# Altium schematic sheet DIGITAL_OUTPUT.SchDoc: Digital output
size A3; Author: eldar6776@hotmail.com; DrawnBy: Eldar Dedic; Organization: PROVEN d.o.o.; Address1: Adema Buće 102; Address2: 71000 Sarajevo; Address3: Federacija BiH; Address4: Bosna i Hercegovina; DocumentNumber: CD-26514; Revision: 001; SheetNumber: 5; SheetTotal: 8; ProjectName: KONTROLER TRANSPORTA MATERIJALA
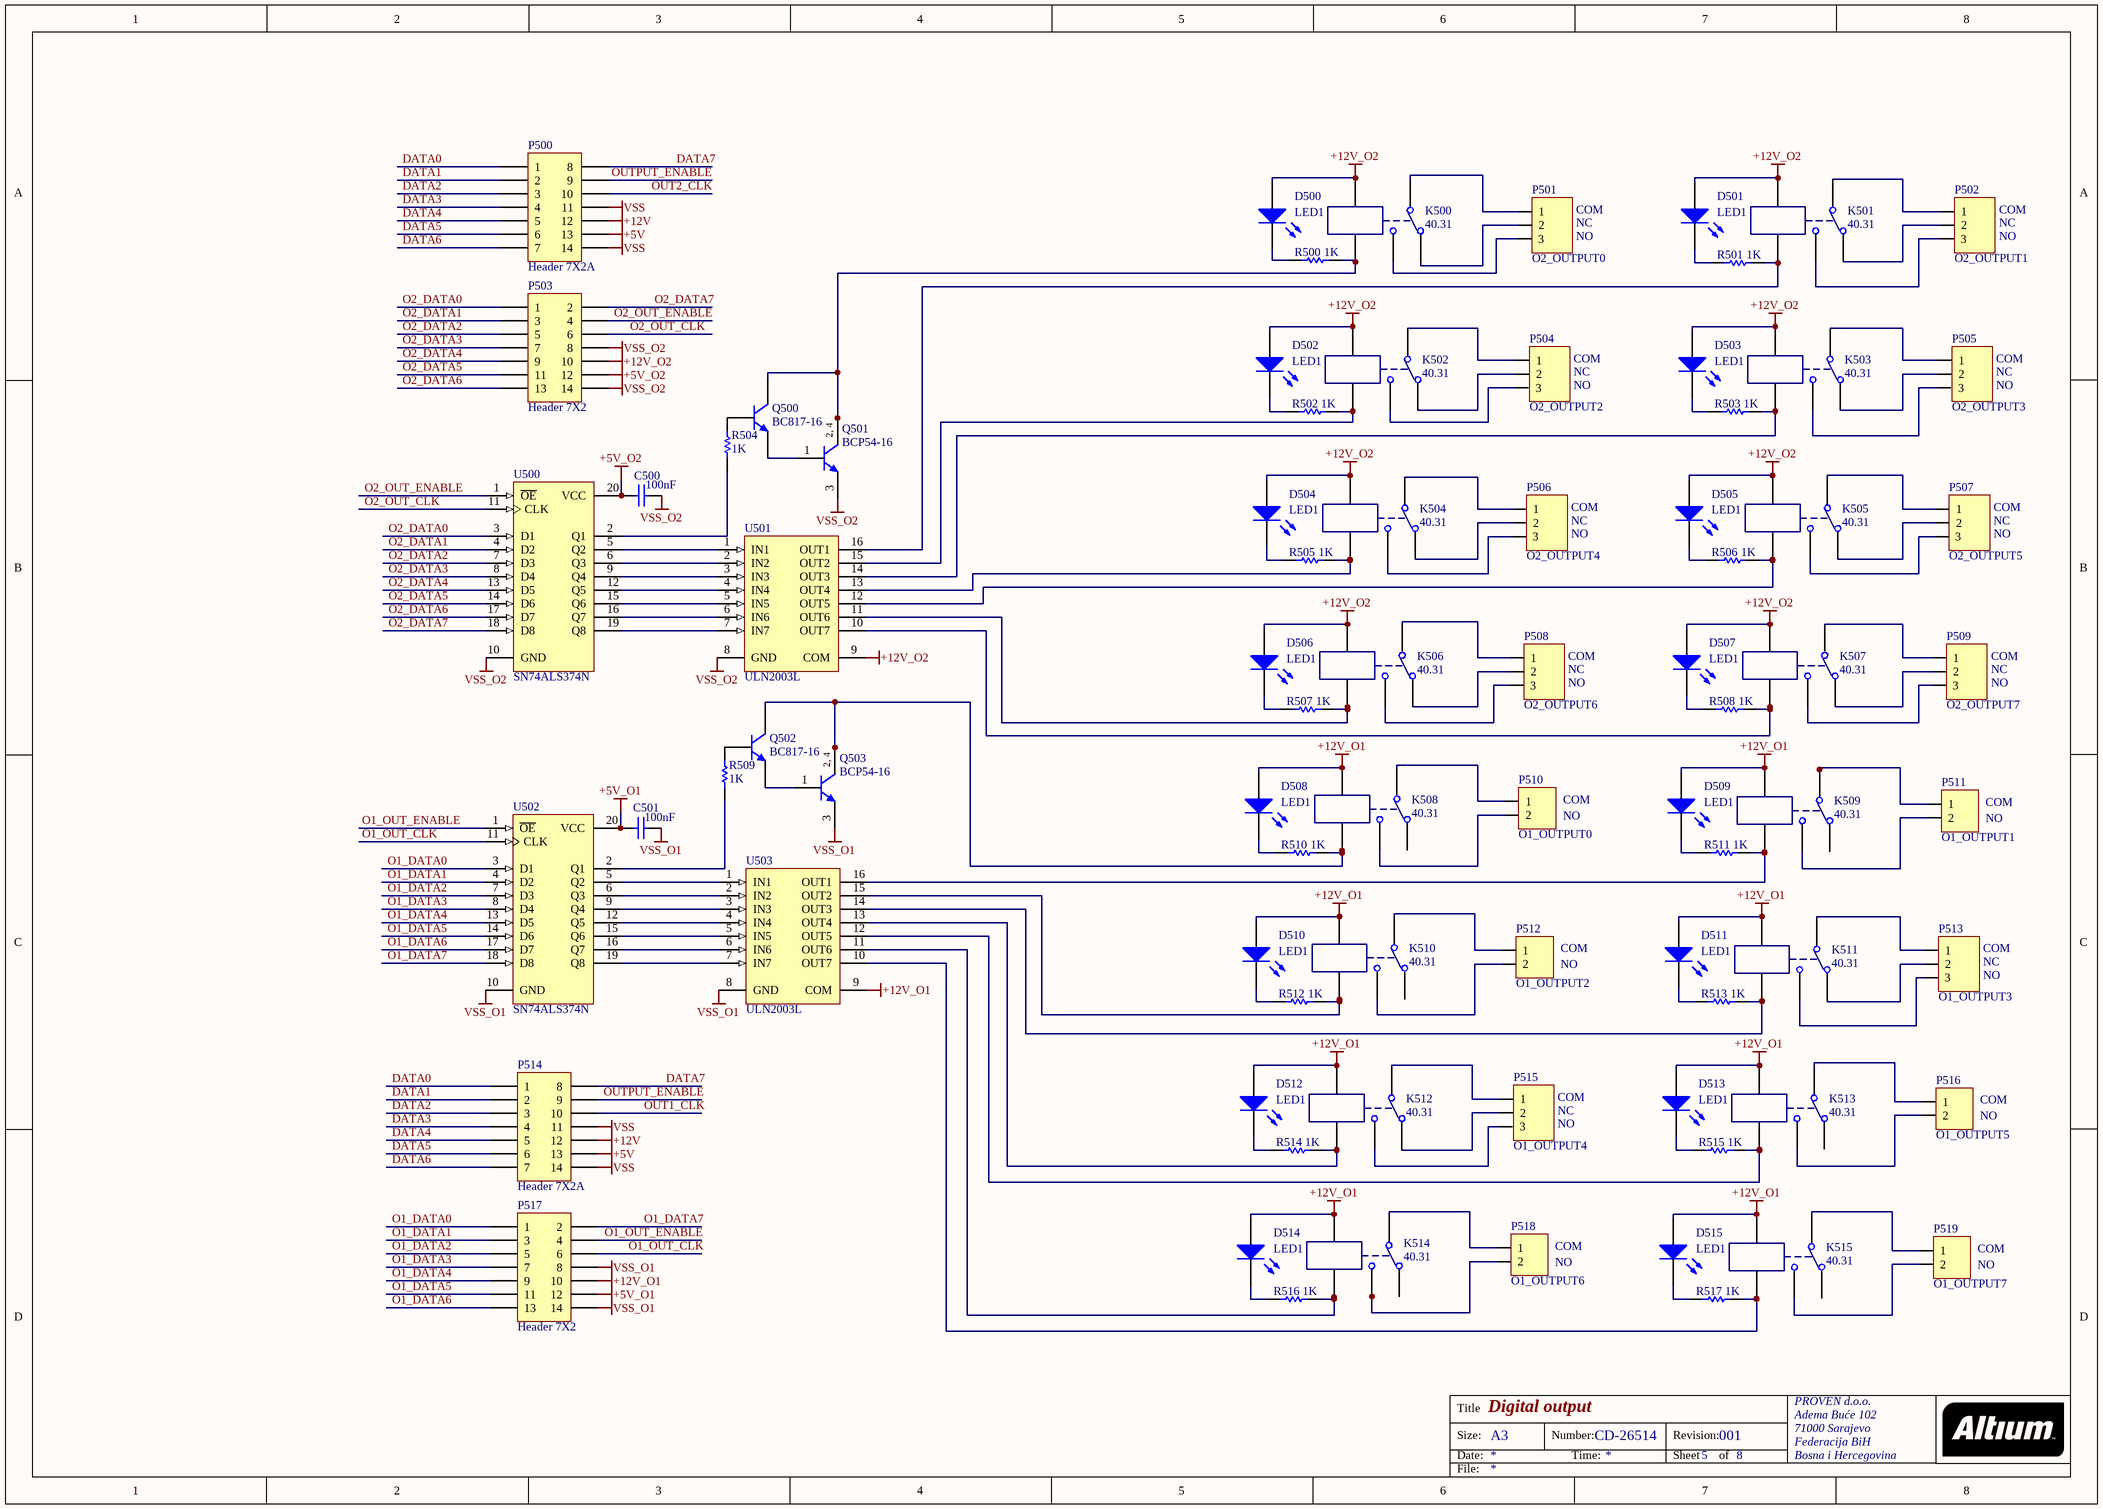
[diagram p0: DIGITAL_OUTPUT.SchDoc]

## Parts
C500  value 100nF  [1206]
C501  value 100nF  [1206]
D500  LED1  [LED-1]
D501  LED1  [LED-1]
D502  LED1  [LED-1]
D503  LED1  [LED-1]
D504  LED1  [LED-1]
D505  LED1  [LED-1]
D506  LED1  [LED-1]
D507  LED1  [LED-1]
D508  LED1  [LED-1]
D509  LED1  [LED-1]
D510  LED1  [LED-1]
D511  LED1  [LED-1]
D512  LED1  [LED-1]
D513  LED1  [LED-1]
D514  LED1  [LED-1]
D515  LED1  [LED-1]
K500  40.31  [40.31 FINDER]
K501  40.31  [40.31 FINDER]
K502  40.31  [40.31 FINDER]
K503  40.31  [40.31 FINDER]
K504  40.31  [40.31 FINDER]
K505  40.31  [40.31 FINDER]
K506  40.31  [40.31 FINDER]
K507  40.31  [40.31 FINDER]
K508  40.31  [40.31 FINDER]
K509  40.31  [40.31 FINDER]
K510  40.31  [40.31 FINDER]
K511  40.31  [40.31 FINDER]
K512  40.31  [40.31 FINDER]
K513  40.31  [40.31 FINDER]
K514  40.31  [40.31 FINDER]
K515  40.31  [40.31 FINDER]
P500  Header 7X2A  [HDR2X7_CEN]
P501  O2_OUTPUT0  [TERMINAL BLOK]
P502  O2_OUTPUT1  [TERMINAL BLOK]
P503  Header 7X2  [HDR2X7]
P504  O2_OUTPUT2  [TERMINAL BLOK]
P505  O2_OUTPUT3  [TERMINAL BLOK]
P506  O2_OUTPUT4  [TERMINAL BLOK]
P507  O2_OUTPUT5  [TERMINAL BLOK]
P508  O2_OUTPUT6  [TERMINAL BLOK]
P509  O2_OUTPUT7  [TERMINAL BLOK]
P510  O1_OUTPUT0  [TERMINAL BLOK 2]
P511  O1_OUTPUT1  [TERMINAL BLOK 2]
P512  O1_OUTPUT2  [TERMINAL BLOK 2]
P513  O1_OUTPUT3  [TERMINAL BLOK]
P514  Header 7X2A  [HDR2X7_CEN]
P515  O1_OUTPUT4  [TERMINAL BLOK]
P516  O1_OUTPUT5  [TERMINAL BLOK 2]
P517  Header 7X2  [HDR2X7]
P518  O1_OUTPUT6  [TERMINAL BLOK 2]
P519  O1_OUTPUT7  [TERMINAL BLOK 2]
Q500  BC817-16  [SOT23_N]
Q501  BCP54-16  [SOT223_N]
Q502  BC817-16  [SOT23_N]
Q503  BCP54-16  [SOT223_N]
R500  1K  [ERA-0805]
R501  1K  [ERA-0805]
R502  1K  [ERA-0805]
R503  1K  [ERA-0805]
R504  1K  [ERA-0805]
R505  1K  [ERA-0805]
R506  1K  [ERA-0805]
R507  1K  [ERA-0805]
R508  1K  [ERA-0805]
R509  1K  [ERA-0805]
R510  1K  [ERA-0805]
R511  1K  [ERA-0805]
R512  1K  [ERA-0805]
R513  1K  [ERA-0805]
R514  1K  [ERA-0805]
R515  1K  [ERA-0805]
R516  1K  [ERA-0805]
R517  1K  [ERA-0805]
U500  SN74ALS374N  [N020D]
U501  ULN2003L  [L16_N]
U502  SN74ALS374N  [N020D]
U503  ULN2003L  [L16_N]

## Nets
+5V: P500.13 P514.13
+5V_O1: C501.1 P517.12 U502.20(VCC)
+5V_O2: C500.1 P503.12 U500.20(VCC)
+12V: P500.12 P514.12
+12V_O1: D508.1(A) D509.1(A) D510.1(A) D511.1(A) D512.1(A) D513.1(A) D514.1(A) D515.1(A) K508.1 K509.1 K510.1 K511.1 K512.1 K513.1 K514.1 K515.1 P517.10 U503.9(COM)
+12V_O2: D500.1(A) D501.1(A) D502.1(A) D503.1(A) D504.1(A) D505.1(A) D506.1(A) D507.1(A) K500.1 K501.1 K502.1 K503.1 K504.1 K505.1 K506.1 K507.1 P503.10 U501.9(COM)
VSS: P500.11 P500.14 P514.11 P514.14
VSS_O1: C501.2 P517.8 P517.14 Q503.3(E) U502.10(GND) U503.8(GND)
VSS_O2: C500.2 P503.8 P503.14 Q501.3(E) U500.10(GND) U501.8(GND)
DATA0: P500.1 P514.1
DATA1: P500.2 P514.2
DATA2: P500.3 P514.3
DATA3: P500.4 P514.4
DATA4: P500.5 P514.5
DATA5: P500.6 P514.6
DATA6: P500.7 P514.7
DATA7: P500.8 P514.8
O1_DATA0: P517.1 U502.3(D1)
O1_DATA1: P517.3 U502.4(D2)
O1_DATA2: P517.5 U502.7(D3)
O1_DATA3: P517.7 U502.8(D4)
O1_DATA4: P517.9 U502.13(D5)
O1_DATA5: P517.11 U502.14(D6)
O1_DATA6: P517.13 U502.17(D7)
O1_DATA7: P517.2 U502.18(D8)
O1_OUT_CLK: P517.6 U502.11(CLK)
O1_OUT_ENABLE: P517.4 U502.1(~{OE})
O2_DATA0: P503.1 U500.3(D1)
O2_DATA1: P503.3 U500.4(D2)
O2_DATA2: P503.5 U500.7(D3)
O2_DATA3: P503.7 U500.8(D4)
O2_DATA4: P503.9 U500.13(D5)
O2_DATA5: P503.11 U500.14(D6)
O2_DATA6: P503.13 U500.17(D7)
O2_DATA7: P503.2 U500.18(D8)
O2_OUT_CLK: P503.6 U500.11(CLK)
O2_OUT_ENABLE: P503.4 U500.1(~{OE})
OUT1_CLK: P514.10
OUT2_CLK: P500.10
OUTPUT_ENABLE: P500.9 P514.9
NetD500_2: D500.2(K) R500.1
NetD501_2: D501.2(K) R501.1
NetD502_2: D502.2(K) R502.1
NetD503_2: D503.2(K) R503.1
NetD504_2: D504.2(K) R505.1
NetD505_2: D505.2(K) R506.1
NetD506_2: D506.2(K) R507.1
NetD507_2: D507.2(K) R508.1
NetD508_2: D508.2(K) R510.1
NetD509_2: D509.2(K) R511.1
NetD510_2: D510.2(K) R512.1
NetD511_2: D511.2(K) R513.1
NetD512_2: D512.2(K) R514.1
NetD513_2: D513.2(K) R515.1
NetD514_2: D514.2(K) R516.1
NetD515_2: D515.2(K) R517.1
NetK500_2: K500.2 Q500.3(C) Q501.2(C) Q501.4(C) R500.2
NetK500_3: K500.3 P501.1
NetK500_4: K500.4 P501.3
NetK500_5: K500.5 P501.2
NetK501_2: K501.2 R501.2 U501.16(OUT1)
NetK501_3: K501.3 P502.1
NetK501_4: K501.4 P502.3
NetK501_5: K501.5 P502.2
NetK502_2: K502.2 R502.2 U501.15(OUT2)
NetK502_3: K502.3 P504.1
NetK502_4: K502.4 P504.3
NetK502_5: K502.5 P504.2
NetK503_2: K503.2 R503.2 U501.14(OUT3)
NetK503_3: K503.3 P505.1
NetK503_4: K503.4 P505.3
NetK503_5: K503.5 P505.2
NetK504_2: K504.2 R505.2 U501.13(OUT4)
NetK504_3: K504.3 P506.1
NetK504_4: K504.4 P506.3
NetK504_5: K504.5 P506.2
NetK505_2: K505.2 R506.2 U501.12(OUT5)
NetK505_3: K505.3 P507.1
NetK505_4: K505.4 P507.3
NetK505_5: K505.5 P507.2
NetK506_2: K506.2 R507.2 U501.11(OUT6)
NetK506_3: K506.3 P508.1
NetK506_4: K506.4 P508.3
NetK506_5: K506.5 P508.2
NetK507_2: K507.2 R508.2 U501.10(OUT7)
NetK507_3: K507.3 P509.1
NetK507_4: K507.4 P509.3
NetK507_5: K507.5 P509.2
NetK508_2: K508.2 Q502.3(C) Q503.2(C) Q503.4(C) R510.2
NetK508_3: K508.3 P510.1
NetK508_4: K508.4 P510.2
NetK509_2: K509.2 R511.2 U503.16(OUT1)
NetK509_3: K509.3 P511.1
NetK509_4: K509.4 P511.2
NetK510_2: K510.2 R512.2 U503.15(OUT2)
NetK510_3: K510.3 P512.1
NetK510_4: K510.4 P512.2
NetK511_2: K511.2 R513.2 U503.14(OUT3)
NetK511_3: K511.3 P513.1
NetK511_4: K511.4 P513.3
NetK511_5: K511.5 P513.2
NetK512_2: K512.2 R514.2 U503.13(OUT4)
NetK512_3: K512.3 P515.1
NetK512_4: K512.4 P515.3
NetK512_5: K512.5 P515.2
NetK513_2: K513.2 R515.2 U503.12(OUT5)
NetK513_3: K513.3 P516.1
NetK513_4: K513.4 P516.2
NetK514_2: K514.2 R516.2 U503.11(OUT6)
NetK514_3: K514.3 P518.1
NetK514_4: K514.4 P518.2
NetK515_2: K515.2 R517.2 U503.10(OUT7)
NetK515_3: K515.3 P519.1
NetK515_4: K515.4 P519.2
NetQ500_1: Q500.1(B) R504.2
NetQ500_2: Q500.2(E) Q501.1(B)
NetQ502_1: Q502.1(B) R509.2
NetQ502_2: Q502.2(E) Q503.1(B)
NetR504_1: R504.1 U500.2(Q1)
NetR509_1: R509.1 U502.2(Q1)
NetU500_5: U500.5(Q2) U501.1(IN1)
NetU500_6: U500.6(Q3) U501.2(IN2)
NetU500_9: U500.9(Q4) U501.3(IN3)
NetU500_12: U500.12(Q5) U501.4(IN4)
NetU500_15: U500.15(Q6) U501.5(IN5)
NetU500_16: U500.16(Q7) U501.6(IN6)
NetU500_19: U500.19(Q8) U501.7(IN7)
NetU502_5: U502.5(Q2) U503.1(IN1)
NetU502_6: U502.6(Q3) U503.2(IN2)
NetU502_9: U502.9(Q4) U503.3(IN3)
NetU502_12: U502.12(Q5) U503.4(IN4)
NetU502_15: U502.15(Q6) U503.5(IN5)
NetU502_16: U502.16(Q7) U503.6(IN6)
NetU502_19: U502.19(Q8) U503.7(IN7)

Not connected (* = marked no-connect by the designer): K508 5; K509 5; K510 5; K513 5; K514 5; K515 5

## Notes on the sheet
- (near P501) COM
- (near P501) NC
- (near P501) NO
- (near P502) COM
- (near P502) NC
- (near P502) NO
- (near P504) COM
- (near P504) NC
- (near P505) COM
- (near P505) NC
- (near P504) NO
- (near P505) NO
- (near P506) COM
- (near P507) COM
- (near P506) NC
- (near P506) NO
- (near P507) NC
- (near P507) NO
- (near P508) COM
- (near P508) NC
- (near P508) NO
- (near P509) COM
- (near P509) NC
- (near P509) NO
- (near P510) COM
- (near P510) NO
- (near P511) COM
- (near P511) NO
- (near P512) COM
- (near P512) NO
- (near P513) COM
- (near P513) NC
- (near P513) NO
- (near P515) COM
- (near P515) NC
- (near P515) NO
- (near P516) COM
- (near P516) NO
- (near P518) COM
- (near P519) COM
- (near P518) NO
- (near P519) NO
- Title
- Size:
- Date:
- A3
- Number:
- Time:
- Revision:
- Sheet
- of
- File:
- (in symbol BCP54-16) 2, 4

## Library data of the parts
C500 C501 = C1206: Ceramic Chip Capacitor - Standard; Published: 17-Jul-2002; LatestRevisionDate: 19-Mar-2004; LatestRevisionNote: Silkscreen size reduced.; DatasheetDocument: Mar-2001; PackageDocument: Mar-2001; PackageReference: 1206; Publisher: Altium Limited; Code_JEITA: 1206; Code_IPC: 3216 [1206]; ComponentLink1Description: Manufacturer Link; ComponentLink1URL: http://www.kemet.com/; ComponentLink2Description: Datasheet; ComponentLink2URL: http://www.kemet.com/kemet/web/homepage/kechome.nsf/vapubfilesname/F3102TA.pdf/$file/F3102TA.pdf
D500-D515 = LED1: Typical RED GaAs LED; Published: 8-Jun-2000; LatestRevisionDate: 08-Jul-2005; LatestRevisionNote: Mech Layer 1 removed.; PackageReference: LED-1; Publisher: Altium Limited; PackageDescription: LED; 2 Leads
K500-K515 = FINDER 40.31
P500 P514 = Header 7X2A: Header, 7-Pin, Dual row; LatestRevisionDate: 17-Jul-2002; LatestRevisionNote: Re-released for DXP Platform.; Publisher: Altium Limited
P501 P502 P504-P509 P513 P515 = Terminal blok 3 pina: Terminal blok
P503 P517 = Header 7X2: Header, 7-Pin, Dual row; LatestRevisionDate: 17-Jul-2002; LatestRevisionNote: Re-released for DXP Platform.; Publisher: Altium Limited
P510-P512 P516 P518 P519 = Terminal blok 2 pina: Terminal blok 2
Q500 Q502 = BC817-16: NPN General-purpose Transistor; Published: 17-Sep-2003; LatestRevisionDate: 12-Dec-2006; LatestRevisionNote: IPC-7351 Footprint Added.; DatasheetVersion: Jun-1999; PackageVersion: May-1999; PackageReference: SOT23; Publisher: Altium Limited; PackageDescription: 3-Pin SOT-23 Package 0.95 mm Pitch, 2.3 mm Lead Span; ComponentLink1Description: Manufacturer Link; ComponentLink1URL: http://www.semiconductors.philips.com/; ComponentLink2Description: Datasheet; ComponentLink2URL: http://www.semiconductors.philips.com/acrobat/datasheets/BC817_BC817W_BC337_5.pdf
Q501 Q503 = BCP54-16: NPN Medium Power Transistor; Published: 17-Sep-2003; LatestRevisionDate: 12-Dec-2006; LatestRevisionNote: IPC-7351 Footprint Added.; DatasheetVersion: 10-Oct-2001; PackageVersion: Aug-2001; PackageReference: SOT223; Publisher: Altium Limited; PackageDescription: 4-Pin SOT-223 Package 2.3 mm Pitch, 7 mm Lead Span; ComponentLink1Description: Manufacturer Link; ComponentLink1URL: http://www.semiconductors.philips.com/; ComponentLink2Description: Datasheet; ComponentLink2URL: http://www.semiconductors.philips.com/acrobat/datasheets/BC635_BCP54_BCX54_6.pdf
R500-R517 = ERAS: Metal Film Thermosensitive Chip Resistor, 0.56 Ohm to 10k Ohm Range, 5% Tolerance, 0805 Size, 0.1 W; Note: If flow soldering, adjust pad width of PCB Footprint to 0.7 - 0.8 times the width of the resistor.; Published: 17-Dec-2003; LatestRevisionDate: 19-Mar-2004; LatestRevisionNote: Silkscreen size reduced.; PackageDocument: Mar-2003; PackageReference: ERA-0805; Publisher: Altium Limited; Code_IPC: 2012 [0805]; ComponentLink1Description: Manufacturer Link; ComponentLink1URL: http://www.panasonic.com/industrial/components/resistive_products.htm; ComponentLink2Description: Datasheet; ComponentLink2URL: http://www.panasonic.com/industrial/components/pdf/AOF0000CE1.pdf
U500 U502 = SN74ALS374N: Octal D-Type Edge-Triggered Flip-Flop with 3-State Outputs; Published: 8-Jun-2000; LatestRevisionDate: 04-Mar-2005; LatestRevisionNote: Stylized 3D Model Added.; DatasheetVersion: May-1986; PackageVersion: Oct-1995; PackageReference: N020D; Publisher: Altium Limited; PackageDescription: DIP; 20 Leads; Row Spacing 7.62 mm; Pitch 2.54 mm; ComponentLink1Description: Manufacturer Link; ComponentLink1URL: http://www.ti.com/
U501 U503 = ULN2003L: High-Voltage, High-Current Darlington Array; Published: 13-Oct-2000; LatestRevisionDate: 13-Apr-2006; LatestRevisionNote: IPC-7351 Footprint Added.; DatasheetVersion: 1998; PackageReference: L16; Publisher: Altium Limited; PackageDescription: 16-Pin Small Outline Integrated Circuit 1.27 mm Pitch; Code_JEDEC: MS-012-AC; Code_IPC: SOIC127P600-16; ComponentLink1Description: Manufacturer Link; ComponentLink1URL: http://www.allegromicro.com/